# EAGLE board Artemis_Iridium_Tracker (EAGLE 9.5.2)
REVISION: A
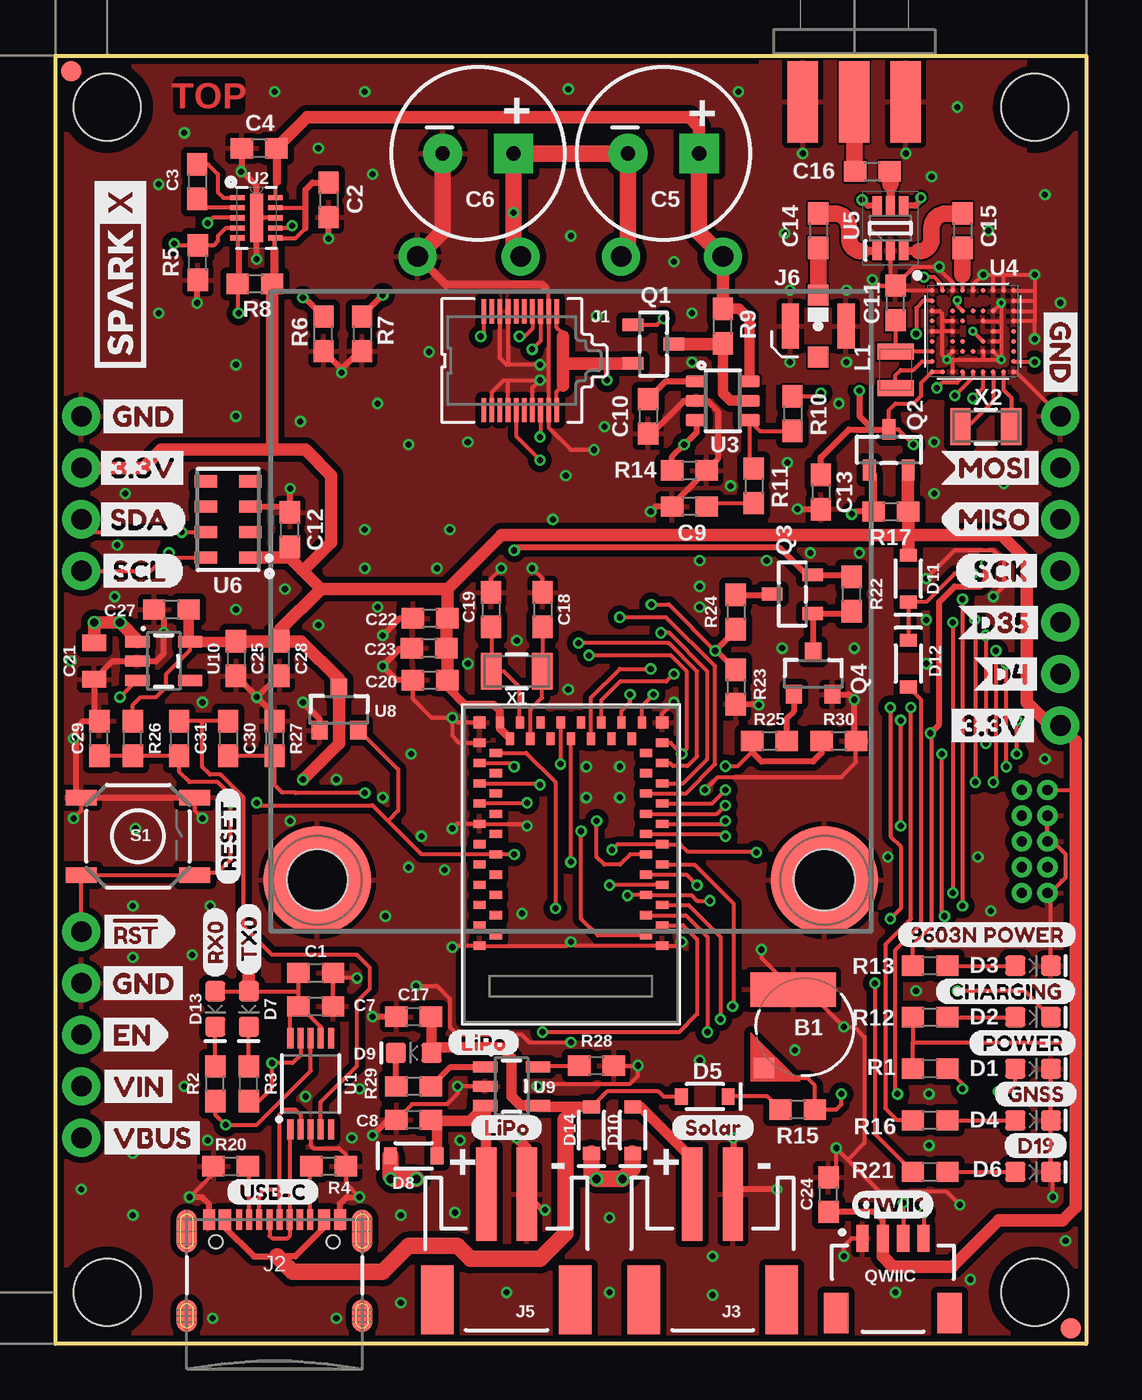
[diagram p4: board, top side]
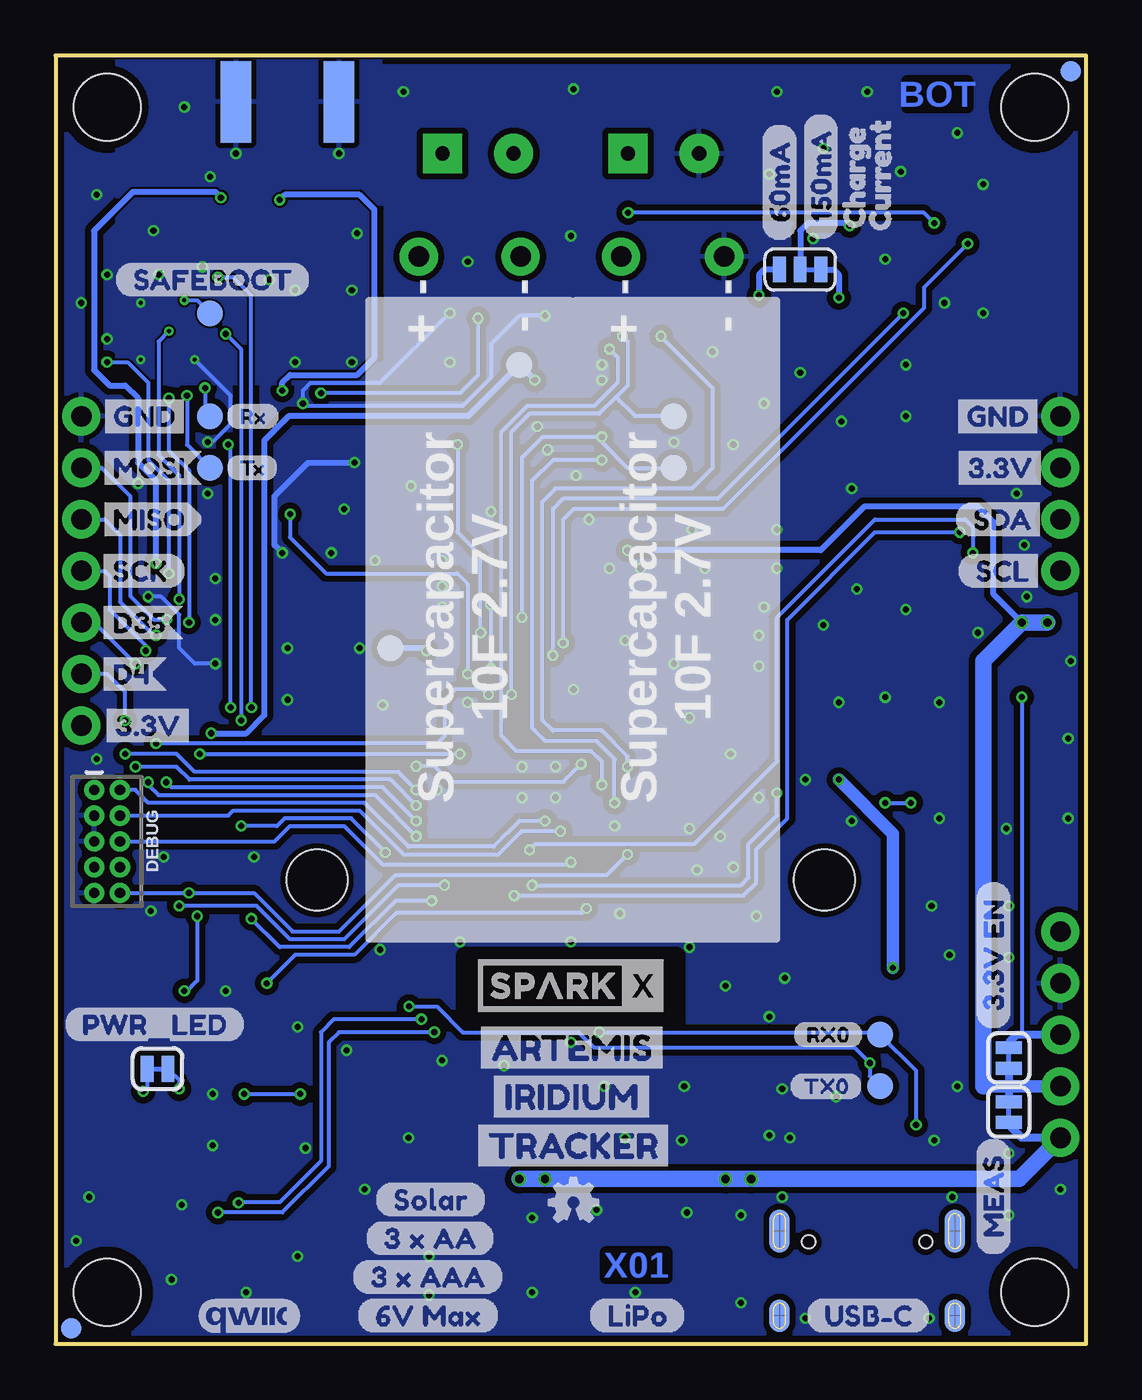
[diagram p5: board, bottom side, seen from below]

Size 50.8 x 63.5 mm. Coordinates in mm from the lower left corner, seen from the top.
Outline: 0,0 0,63.5 50.8,63.5 50.8,0 0,0
Copper layers (1*16): Top 0.035mm / dielectric 1.5mm / Bottom 0.035mm
Design rules "SparkFun-2-layer-FAB-LIMIT": minimum track width 4mil, minimum drill 6mil, track to track 4mil, track to pad 4mil, pad to pad 4mil, via to via 4mil, smd to smd 4mil, copper to edge 4mil, drill to drill 4mil, minimum pad ring 5mil, minimum via ring 5mil, stop-mask expansion 4mil, vias tented up to drill 25mil, thermal gap 10mil
Net classes: 1 3.3V: width 0.203 mm
tRestrict: area 20.2,15.9 to 30.6,19.1
bRestrict: area 20.2,15.9 to 30.6,19.1

## Footprints (pad centres in the part's own frame; a part is rotated, then mirrored left to right if it is on the bottom)
SMT-JUMPER_2_NC_TRACE_SILK = smd 0.635 x 1.27: 1 -0.508,0; 2 0.508,0
PAD.03X.05 = smd 1.27 x 1.27: P$1 0,0
1X01_NO_SILK = drill 1.016 pad 1.88: 1 0,0
ML414H_IV01E = smd 1 x 1: + 2.022,2.032 | smd 4.2 x 1.7: - 0.6,-1.85
0603 = smd 1.1 x 1: 1 -0.85,0; 2 0.85,0
CPOL-RADIAL-1F-2.7V = drill 0.7 pad 1.93 square: + 1.75,0 | drill 0.7 pad 1.93: - -1.75,0
0805 = smd 0.8 x 1.2: 1 -0.9,0; 2 0.9,0
LED-0603 = smd 1 x 1: A -0.877,0; C 0.877,0
SOD-323 = smd 0.63 x 0.83: A 1.15,0; C -1.15,0
2X5-PTH-1.27MM-NO_SILK = drill 0.508 pad 1: 1 -2.54,-0.635; 2 -2.54,0.635; 3 -1.27,-0.635; 4 -1.27,0.635; 5 0,-0.635; 6 0,0.635; 7 1.27,-0.635; 8 1.27,0.635; 9 2.54,-0.635; 10 2.54,0.635
1X04_NO_SILK = drill 1.016 pad 1.88: 1 0,0; 2 2.54,0; 3 5.08,0; 4 7.62,0
IRIDIUM_9603N = smd 0.23 x 1.2: 1 11.8,28.035; 2 11.8,23.165; 3 11.4,28.035; 4 11.4,23.165; 5 11,28.035; 6 11,23.165; 7 10.6,28.035; 8 10.6,23.165; 9 10.2,28.035; 10 10.2,23.165; 11 9.8,28.035; 12 9.8,23.165; 13 9.4,28.035; 14 9.4,23.165; 15 9,28.035; 16 9,23.165; 17 8.6,28.035; 18 8.6,23.165; 19 8.2,28.035; 20 8.2,23.165 | smd 5.3 x 5.3: HOLE1 0,0; HOLE2 25,0 | hole 3: 0,0; 25,0
USB-C-16P = smd 0.3 x 1: A5 -1.25,-0.34; A6 -0.25,-0.34; A7 0.25,-0.34; A8 1.25,-0.34; B5 1.75,-0.34; B6 0.75,-0.34; B7 -0.75,-0.34; B8 -1.75,-0.34 | smd 0.6 x 1: GND -3.225,-0.34; GND2 3.225,-0.34; VBUS1 -2.45,-0.34; VBUS2 2.45,-0.34 | smd 1 x 2.1: SHLD1 -4.32,-0.915; SHLD2 4.32,-0.915 | smd 1 x 2.1 bottom: SHLD3 -4.32,-0.915; SHLD4 4.32,-0.915 | smd 1 x 1.6: SHLD5 -4.32,-5.095; SHLD8 4.32,-5.095 | smd 1 x 1.6 bottom: SHLD6 -4.32,-5.095; SHLD7 4.32,-5.095 | hole 0.65: -2.89,-1.445; 2.89,-1.445
JST-2-SMD = smd 1 x 4.6: 1 -1,-3.7; 2 1,-3.7 | smd 1.6 x 3.4: NC1 -3.4,1.5; NC2 3.4,1.5
1X02_NO_SILK = drill 1.016 pad 1.88: 1 0,0; 2 2.54,0
U.FL = smd 2.2 x 0.85: 1 0,1.375; 2 0,-1.375 | smd 1.05 x 1: FEED 1.525,0; NC -1.525,0
SMA-EDGE = smd 1.5 x 4: GND@0 -2.54,0; GND@1 2.54,0; SIG 0,0 | smd 1.5 x 4 bottom: GND@2 -2.54,0; GND@3 2.54,0
SMT-JUMPER_3_1-NC_TRACE_SILK = smd 0.635 x 1.27: 1 -1.016,0; 2 0,0; 3 1.016,0
FIDUCIAL-1X2 = smd 1 x 1: 1 0,0
STAND-OFF = hole 3.302: 0,0
0806 = smd 0.8 x 1.8: 1 -0.9,0; 2 0.9,0
SOT23-R = smd 0.635 x 1.016: 1 -0.95,-1; 2 0.95,-1; 3 0,1
SOT23-3 = smd 0.8 x 0.9: 1 -0.95,-1; 2 0.95,-1; 3 0,1.1
JST04_1MM_RA = smd 0.6 x 1.35: 1 -1.5,0; 2 -0.5,0; 3 0.5,0; 4 1.5,0 | smd 1.2 x 2: NC1 2.8,-3.675; NC2 -2.8,-3.675
TACTILE_SWITCH_SMD_5.2MM = smd 1.524 x 0.762: 1 -2.794,1.905; 2 2.794,1.905; 3 -2.794,-1.905; 4 2.794,-1.905
1X07_NO_SILK = drill 1.016 pad 1.88: 1 0,0; 2 2.54,0; 3 5.08,0; 4 7.62,0; 5 10.16,0; 6 12.7,0; 7 15.24,0
MSOP10 = smd 1 x 0.3: 1 -2.25,1; 2 -2.25,0.5; 3 -2.25,0; 4 -2.25,-0.5; 5 -2.25,-1; 6 2.25,-1; 7 2.25,-0.5; 8 2.25,0; 9 2.25,0.5; 10 2.25,1
DFN300X200-10L = smd 0.711 x 0.254: 1 -0.94,0.991; 2 -0.94,0.508; 3 -0.94,0; 4 -0.94,-0.508; 5 -0.94,-0.991; 6 0.94,-0.991; 7 0.94,-0.508; 8 0.94,0; 9 0.94,0.508; 10 0.94,0.991 | smd 0.635 x 2.388: 11 0,0
TSOT6 = smd 0.6 x 1.05: 1 -0.95,-1.3; 2 0,-1.3; 3 0.95,-1.3; 4 0.95,1.3; 5 0,1.3; 6 -0.95,1.3
UBLOX_ZOE_M8-0-10 = smd 0.25 x 0.25: 1 -1.996,2.004; 2 -1.496,2.004; 3 -0.996,2.004; 4 -0.496,2.004; 5 0.004,2.004; 6 0.504,2.004; 7 1.004,2.004; 8 1.504,2.004; 9 2.004,2.004; 10 2.004,1.504; 11 2.004,1.004; 12 2.004,0.504; 13 2.004,0.004; 14 2.004,-0.496; 15 2.004,-0.996; 16 2.004,-1.496; 17 2.004,-1.996; 18 1.504,-1.996; 19 1.004,-1.996; 20 0.504,-1.996; 21 0.004,-1.996; 22 -0.496,-1.996; 23 -0.996,-1.996; 24 -1.496,-1.996; 25 -1.996,-1.996; 26 -1.996,-1.496; 27 -1.996,-0.996; 28 -1.996,-0.496; 29 -1.996,0.004; 30 -1.996,0.504; 31 -1.996,1.004; 32 -1.996,1.504; 33 -0.996,1.004; 34 -0.496,1.004; 35 0.004,1.004; 36 0.504,1.004; 37 1.004,1.004; 38 1.004,0.004; 39 1.004,-0.496; 40 1.004,-0.996; 41 0.504,-0.996; 42 0.004,-0.996; 43 -0.496,-0.996; 44 -0.996,-0.996; 45 -0.996,-0.496; 46 -0.996,0.004; 47 -0.996,0.504; 48 -0.496,0.504; 49 0.504,0.504; 50 0.504,-0.496; 51 -0.496,-0.496
SOT65P220X100-6N = smd 0.95 x 0.45: 1 -1.1,0.65; 2 -1.1,0; 3 -1.1,-0.65; 4 1.1,-0.65; 5 1.1,0; 6 1.1,0.65
MS8607-02BA01 = smd 1.1 x 0.6: 1 -1.1,1.875; 2 -1.1,0.625; 3 -1.1,-0.625; 4 -1.1,-1.875; 5 1.1,-1.875; 6 1.1,-0.625; 7 1.1,0.625; 8 1.1,1.875
ARTEMIS_FP = smd 0.4 x 0.6: AD16 -4,-3.7; BOOT 1.5,4.5; D0 0.5,-4.5; D1 -0.5,-4.5; D2 -1,-3.7; D3 2,-3.7; D7 -1.5,4.5; D8 -0.5,4.5; D9 2,3.7; D10 1,3.7; D14 -5,3.7; D17 -3.5,-4.5; D36 2.5,-4.5; D38 3,-3.7; D40 2.5,4.5; D41 -2.5,-4.5; GND@1 4.5,4.5; GND@39 -5.5,-4.5; GND@47 -1.5,-4.5; GND@59 4.5,-4.5; RXI-0 3.5,4.5; SWDCK 4,3.7; SWDIO 0,3.7; TXO-0 0.5,4.5; ~AD31 -3,-3.7; ~AD35 -2,3.7; ~D4 -2.5,4.5; ~D5 -1,3.7; ~D18 -4.5,-4.5; ~D19 -5,-3.7; ~D22 -3.5,4.5; ~D23 -4,3.7; ~D24 -3,3.7; ~D27 -4.5,4.5; ~D28 -5.5,4.5; ~D37 3.5,-4.5; ~D39 3,3.7; ~D42 1.5,-4.5; ~D43 1,-3.7; ~D44 4,-3.7; ~D45 -2,-3.7; ~RST 0,-3.7 | smd 0.6 x 0.4: AD34 -6.5,-0.5; D15 -6.5,0.5; VDD@36 -5.7,-3; VDD@37 -6.5,-3.5; XI -6.5,-2.5; XO -5.7,-2; ~AD11 -5.7,-1; ~AD12 -5.7,2; ~AD13 -5.7,1; ~AD29 -6.5,-1.5; ~AD32 -5.7,3; ~AD33/SWO -5.7,0; ~D6 -6.5,3.5; ~D25 -6.5,2.5; ~D26 -6.5,1.5 | smd 0.6 x 0.6: GND@22 -6.5,4.5; GND@38 -6.5,-4.5
SSOP3 = smd 0.8 x 0.9: 1 -0.95,-1; 2 0.95,-1; 3 0,1.1
SOT23-5 = smd 0.55 x 1.2: 1 -0.95,-1.3; 2 0,-1.3; 3 0.95,-1.3; 4 0.95,1.3; 5 -0.95,1.3
CRYSTAL-SMD-3.2X1.5MM = smd 1 x 1.8: P$1 -1.25,0; P$2 1.25,0

## Placement (x,y rotation side)
3V3EN  JUMPER-SMT_2_NC_TRACE_SILK  [SMT-JUMPER_2_NC_TRACE_SILK]  3.81,14.1 90 bottom
5V3  TEST-POINT3X5  [PAD.03X.05]  27.94,48.26 0 bottom
!RESET  [1X01_NO_SILK]  1.27,20.32 0 top
B1  ML414H_IV01E_BATTERY  [ML414H_IV01E]  36.96,15.62 180 top
C1  10nF  [0603]  12.83,18.29 0 top
C2  2.2uF  [0603]  13.46,56.39 270 top
C3  1.0uF  [0603]  6.99,57.28 270 top
C4  0.22uF  [0603]  10.03,58.93 180 top
C5  1F 2.7V  [CPOL-RADIAL-1F-2.7V]  29.97,58.67 0 top
C6  1F 2.7V  [CPOL-RADIAL-1F-2.7V]  20.83,58.67 0 top
C7  0.1uF  [0603]  12.83,16.64 0 top
C8  4.7uF  [0603]  17.65,11.05 180 top
C9  10nF  [0603]  31.24,41.27 180 top
C10  1.0uF  [0603]  29.21,45.72 270 top
C11  4.7uF  [0603]  41.4,51.31 90 top
C12  0.22uF  [0603]  11.56,40.13 90 top
C13  0.1uF  [0603]  37.72,41.99 270 top
C14  100pF  [0603]  37.59,54.86 270 top
C15  100pF  [0603]  44.7,54.86 270 top
C16  100pF  [0603]  40.26,57.78 0 top
C17  4.7uF  [0603]  17.65,16.13 180 top
C18  15pF  [0603]  24,36.2 270 top
C19  15pF  [0603]  21.46,36.2 270 top
C20  0.1uF  [0603]  18.47,32.72 0 top
C21  22uF  [0805]  1.91,33.66 270 top
C22  10uF  [0603]  18.47,35.76 180 top
C23  1.0uF  [0603]  18.41,34.29 180 top
C24  1.0uF  [0603]  38.1,7.37 90 top
C25  22uF  [0603]  8.89,33.78 270 top
C27  1.0uF  [0603]  5.71,36.2 180 top
C28  0.1uF  [0603]  11.05,33.78 270 top
C29  1nF  [0603]  2.16,29.84 90 top
C30  0.1uF  [0603]  8.51,29.84 270 top
C31  0.1uF  [0603]  6.1,29.84 270 top
D1  GREEN  [LED-0603]  48.18,13.56 0 top
D2  Yellow  [LED-0603]  48.18,16.1 0 top
D3  RED  [LED-0603]  48.18,18.64 0 top
D4  BLUE  [LED-0603]  48.18,11.02 0 top
D5  0.5A/40V/420mV  [SOD-323]  32,12.19 180 top
D6  WHITE  [LED-0603]  48.18,8.48 0 top
D7  GREEN  [LED-0603]  9.53,16.51 270 top
D8  0.5A/40V/420mV  [SOD-323]  17.65,9.27 0 top
D9  Yellow  [LED-0603]  17.65,14.35 180 top
D10  0.5A/40V/420mV  [SOD-323]  28.45,10.54 90 top
D11  0.5A/40V/420mV  [SOD-323]  42.04,37.72 90 top
D12  0.5A/40V/420mV  [SOD-323]  42.04,33.53 270 top
D13  Yellow  [LED-0603]  7.87,16.51 270 top
D14  0.5A/40V/420mV  [SOD-323]  26.42,10.54 90 top
DEBUG  CORTEX_DEBUG  [2X5-PTH-1.27MM-NO_SILK]  48.26,24.77 270 bottom
EN  [1X01_NO_SILK]  1.27,15.24 0 top
FRAME1  FRAME-LETTER  [CREATIVE_COMMONS]  -7.62,-13.97 0 top  (outside the outline)
FRAME2  FRAME-LETTER  [CREATIVE_COMMONS]  -7.62,-13.97 0 top  (outside the outline)
FRAME3  FRAME-LETTER  [CREATIVE_COMMONS]  -7.62,-13.97 0 top  (outside the outline)
FRAME4  FRAME-LETTER  [CREATIVE_COMMONS]  -7.62,-13.97 0 top  (outside the outline)
GND  [1X01_NO_SILK]  1.27,17.78 0 top
GPS_RX  TEST-POINT3X5  [PAD.03X.05]  43.18,45.72 0 bottom
GPS_TX  TEST-POINT3X5  [PAD.03X.05]  43.18,43.18 0 bottom
I2C  PTH  [1X04_NO_SILK]  1.27,45.72 270 top
J1  IRIDIUM_9603N  [IRIDIUM_9603N]  12.9,22.86 0 top
J2  USB-C  [USB-C-16P]  10.79,6.48 0 top
J3  [JST-2-SMD]  32.38,3.68 180 top
J4  [1X02_NO_SILK]  1.27,12.7 270 top
J5  [JST-2-SMD]  22.23,3.68 180 top
J6  U.FL  [U.FL]  37.59,50.16 90 top
J7  ANTENNA-GROUNDEDEDGE_SMA  [SMA-EDGE]  39.37,61.21 0 top
JP1  JUMPER-SMT_3_1-NC_TRACE_SILK  [SMT-JUMPER_3_1-NC_TRACE_SILK]  14.1,52.96 0 bottom
JP2  JUMPER-SMT_2_NC_TRACE_SILK  [SMT-JUMPER_2_NC_TRACE_SILK]  45.77,13.56 0 bottom
JP7  FIDUCIAL1X2  [FIDUCIAL-1X2]  0.76,62.74 0 bottom
JP8  FIDUCIAL1X2  [FIDUCIAL-1X2]  50.04,0.76 0 top
JP9  STAND-OFF  [STAND-OFF]  2.54,60.96 0 top
JP10  STAND-OFF  [STAND-OFF]  48.26,60.96 0 top
JP11  STAND-OFF  [STAND-OFF]  2.54,2.54 0 top
JP12  STAND-OFF  [STAND-OFF]  48.26,2.54 0 top
JP13  FIDUCIAL1X2  [FIDUCIAL-1X2]  50.04,0.76 0 bottom
JP14  FIDUCIAL1X2  [FIDUCIAL-1X2]  0.76,62.74 0 top
L1  2.2uH  [0806]  41.4,48.01 270 top
LOGO4  OSHW-LOGOMINI  [OSHW-LOGO-MINI]  25.27,6.99 0 bottom
MEAS  JUMPER-SMT_2_NC_TRACE_SILK  [SMT-JUMPER_2_NC_TRACE_SILK]  3.81,11.43 90 bottom
Q1  DMG3414U-7  [SOT23-R]  29.46,49.28 270 top
Q2  DMG3415U-7  [SOT23-R]  41.07,44.07 0 top
Q3  DMG3415U-7  [SOT23-R]  36.32,36.96 90 top
Q4  600mA/40V  [SOT23-3]  37.34,33.02 0 top
QWIIC  QWIIC_RIGHT_ANGLE  [JST04_1MM_RA]  41.27,5.21 0 top
R1  1k  [0603]  43.1,13.56 180 top
R2  1k  [0603]  7.87,12.83 90 top
R3  1k  [0603]  9.53,12.83 90 top
R4  5.1k  [0603]  13.46,8.76 180 top
R5  10k  [0603]  7.01,53.29 90 top
R6  12k  [0603]  13.21,49.78 90 top
R7  30.1k  [0603]  15.11,49.78 270 top
R8  100k  [0603]  9.83,52.25 0 top
R9  0.012R  [0603]  32.89,50.16 90 top
R10  100  [0603]  36.32,45.85 270 top
R11  100  [0603]  34.42,42.29 270 top
R12  1k  [0603]  43.1,16.1 180 top
R13  2.2k  [0603]  43.1,18.64 180 top
R14  10k  [0603]  31.24,43.05 0 top
R15  62KOHM-0603-1/10W-5%  [0603]  36.58,11.56 180 top
R16  1k  [0603]  43.1,11.02 180 top
R17  10k  [0603]  41.17,41.02 0 top
R20  5.1k  [0603]  8.64,8.76 0 top
R21  1k  [0603]  43.1,8.48 180 top
R22  10k  [0603]  39.24,36.96 90 top
R23  10k  [0603]  33.53,32.38 270 top
R24  20k  [0603]  33.53,36.07 270 top
R25  1k  [0603]  35.18,29.72 0 top
R26  100k  [0603]  3.81,29.84 90 top
R27  220k  [0603]  10.79,29.84 270 top
R28  2.0k  [0603]  26.67,13.72 180 top
R29  1k  [0603]  17.65,12.7 180 top
R30  10k  [0603]  38.61,29.72 0 top
RX0  TEST-POINT3X5  [PAD.03X.05]  10.16,15.24 0 bottom
RX1  TEST-POINT3X5  [PAD.03X.05]  20.32,45.72 0 bottom
S1  RESET  [TACTILE_SWITCH_SMD_5.2MM]  4.06,25.02 0 top
SAFEBOOT  TEST-POINT3X5  [PAD.03X.05]  43.18,50.8 0 bottom
SC1+  [1X01_NO_SILK]  32.89,53.59 0 top
SC1-  [1X01_NO_SILK]  27.88,53.59 0 top
SC2+  [1X01_NO_SILK]  22.92,53.59 0 top
SC2-  [1X01_NO_SILK]  17.84,53.59 0 top
SPARKX1  SPARKX-LOGO4  [SPARKX-MEDIUM]  3.2,52.7 90 top
SPARKX2  SPARKX-LOGO4  [SPARKX-MEDIUM]  25.4,17.65 0 bottom
SPI  [1X07_NO_SILK]  49.53,45.72 270 top
TX0  TEST-POINT3X5  [PAD.03X.05]  10.16,12.7 0 bottom
TX1  TEST-POINT3X5  [PAD.03X.05]  20.32,43.18 0 bottom
U1  CH340E_MSOP10  [MSOP10]  12.57,12.83 90 top
U2  LTC3225EDDB#TRMPBF  [DFN300X200-10L]  9.91,55.5 0 top
U3  ADM4210-1  [TSOT6]  32.89,46.48 270 top
U4  UBLOX_ZOE_M8-0-10  [UBLOX_ZOE_M8-0-10]  45.21,49.91 0 top
U5  AS179-92LF  [SOT65P220X100-6N]  41.15,54.99 90 top
U6  MS8607-02BA01  [MS8607-02BA01]  8.51,40.64 180 top
U7  ARTEMIS_MODULESMD  [ARTEMIS_FP]  25.4,24.13 270 top
U8  V_SUPERVISORBD48K24G-TL  [SSOP3]  13.97,31.24 0 top
U9  MCP73831  [SOT23-5]  22.48,12.7 270 top
U10  3.3V  [SOT23-5]  5.33,33.66 270 top
U$1  [60MA0]  15.11,54.36 90 bottom
U$2  [POWER0]  45.01,14.83 0 top
U$3  [GND1]  6.78,45.72 0 bottom
U$4  [3#3V2]  6.76,43.18 0 bottom
U$5  [SCL0]  6.35,38.1 0 bottom
U$6  [SDA0]  6.48,40.64 0 bottom
U$7  [EN0]  1.91,15.24 0 top
U$9  [CHARGING0]  43.36,17.37 0 top
U$10  [9603N_POWER0]  41.45,20.17 0 top
U$11  [QWIIC_4MM]  41.27,6.86 0 top
U$12  [GND1]  48.84,45.72 0 bottom
U$13  [150MA0]  13.08,54.36 90 bottom
U$14  [CHARGE0]  11.43,54.1 90 bottom
U$15  [CURRENT0]  10.16,53.98 90 bottom
U$16  [TX00]  9.53,18.16 90 top
U$17  [GND1]  49.53,51.31 270 top
U$18  [SCK0]  44.32,38.1 0 top
U$19  [GNSS0]  46.23,12.32 0 top
U$20  [3#3V2]  48.77,30.48 0 bottom
U$21  [3#3V2]  1.78,43.18 0 top
U$22  [GND1]  1.91,45.72 0 top
U$23  [RX00]  7.87,18.03 90 top
U$24  [3#3V2]  43.69,30.48 0 top
U$25  [QWIIC_5MM]  41.27,1.4 0 bottom
U$26  [SCL9]  1.91,38.1 0 top
U$27  [SDA8]  1.78,40.64 0 top
U$29  [SOLAR0]  30.35,10.67 0 top
U$31  [SCK0]  48.9,38.1 0 bottom
U$32  [5#3V0]  27.94,42.67 90 bottom
U$33  [RX0]  42.42,45.72 0 bottom
U$34  [RX00]  14.48,15.24 0 bottom
U$35  [RX10]  19.56,45.72 0 bottom
U$36  [SAFEBOOT0]  47.88,52.45 0 bottom
U$37  [TX0]  42.42,43.18 0 bottom
U$38  [TX00]  14.61,12.7 0 bottom
U$39  [TX10]  19.68,43.18 0 bottom
U$40  [ARTEMIS0]  30.48,14.61 0 bottom
U$41  [IRIDIUM0]  29.84,12.19 0 bottom
U$42  [TRACKER0]  30.61,9.78 0 bottom
U$43  [PWR_LED0]  50.42,15.75 0 bottom
U$44  [VBUS0]  1.91,10.16 0 top
U$45  [LIPO0]  20.45,10.67 0 top
U$46  [LIPO0]  19.3,14.86 0 top
U$47  [3#3V_EN0]  4.57,15.49 90 bottom
U$48  [MEAS0]  4.57,4.32 90 bottom
U$49  [RESET0]  8.51,22.61 90 top
U$50  [D190]  46.74,9.78 0 top
U$53  [USB#C0]  13.84,1.4 0 bottom
U$56  [USB#C0]  8.38,7.49 0 top
U$57  [LIPO0]  24.51,1.4 0 bottom
U$58  [#RST0]  1.78,20.32 0 top
U$59  [GND0]  1.91,17.78 0 top
U$60  [VIN0]  1.91,12.7 0 top
U$61  [3_X_AA0]  35.56,5.21 0 bottom
U$62  [3_X_AAA0]  36.2,3.3 0 bottom
U$63  [6V_MAX0]  35.94,1.4 0 bottom
U$64  [SOLAR0]  35.05,7.11 0 bottom
U$65  [VIN#30]  34.16,35.05 90 bottom
U$67  [D350]  48.9,35.56 0 bottom
U$68  [D350]  44.45,35.56 0 top
U$69  [MISO0]  48.9,40.64 0 bottom
U$70  [MISO0]  43.56,40.64 0 top
U$71  [MOSI0]  43.56,43.18 0 top
U$72  [MOSI0]  48.9,43.18 0 bottom
U$73  [D40]  45.21,33.02 0 top
U$74  [D40]  48.9,33.02 0 bottom
VIN/3  TEST-POINT3X5  [PAD.03X.05]  34.29,34.29 270 bottom
X1  32.768kHz  [CRYSTAL-SMD-3.2X1.5MM]  22.73,33.15 0 top
X2  32.768kHz  [CRYSTAL-SMD-3.2X1.5MM]  45.85,45.21 0 top

## Tracks (layer width: path | path; a pad name or v marks a point on that pad's centre or on a via)
3.3V  (via drill 0.3)
  Top 0.203: 10.79,53.98 10.79,54.46 U2.6 11.84,54.51 12.32,54.99 | U2.9 12.32,56.01 | C7.1 11.98,17.4 | 11.98,17.4 C1.1 | D13.A D7.A 11.96,17.39 11.98,17.4 | U1.10 11.57,16.23 C7.1 | U1.7 13.07,15.63 12.06,16.64 C7.1 | R26.2 3.81,31.5 4.19,31.88 4.95,31.88 5.46,32.38 5.46,33.02 6.63,34.19 U10.5 | DEBUG.1 50.29,27.3 | R1.2 42.25,14.86 | 42.25,14.86 50.29,14.86 | R12.2 42.25,14.86
  Top 0.305: R8.2 10.79,52.36 | C2.1 12.66,57.24 12.32,56.9 12.32,56.01 12.32,54.99 | QWIIC.2 40.77,6.09 40.35,6.52 C24.1
  Top 0.406: U7.VDD@36 21.9,30.33 U7.VDD@37 21.9,31.19 21.59,31.5 20.19,31.5 19.32,32.37 C20.2 | 19.32,34.24 C23.1 | 10.79,52.36 10.79,53.98
  Top 0.508: C27.1 6.57,34.67 U10.5 8.86,34.6 C25.1
  Top 0.61: C20.2 19.32,34.24 | C23.1 19.27,35.71 C22.1 19.32,37.21 | C25.1 C28.1 | C28.1 11.05,35.18 13.08,37.21 | 13.08,37.21 19.32,37.21 | U6.1 11.53,38.77 | 11.53,38.77 11.56,38.77 C12.1 | 11.53,38.77 12.13,38.16 | 12.13,38.16 13.08,37.21 | D11.A 42.02,38.88 42.02,39.88 | 42.02,39.88 R17.2 Q2.2 | 42.02,39.88 46.61,39.88 47.88,38.61 47.88,31.62 49.02,30.48 SPI.7 50.29,29.72 50.29,27.3 50.29,14.86 50.29,6.73 49.66,6.1 46.48,6.1 44.2,3.81 41.27,3.81 40.77,4.31 QWIIC.2 | v9.53,18.54 D7.A | I2C.2 4.32,43.18 5.21,44.07 10.67,44.07 | 10.67,44.07 12.32,44.07 13.59,42.8 13.59,39.5 12.26,38.16 12.13,38.16 | 10.67,44.07 10.68,44.08 R8.2 | 19.32,37.21 21.98,39.88 42.02,39.88 | C28.1 12.1,34.63 13.97,32.77 U8.3 13.97,29.59 v12.19,27.81
  Bottom 0.61: v12.19,27.81 9.53,25.15 v9.53,18.54
3V3SW  (via drill 0.3)
  Top 0.203: Q2.3 41.07,46.02 41.4,46.35 42.29,46.35 42.67,46.74 42.67,47.37 U4.25 U4.24 | 40.27,45.07 Q2.3 | R16.2 41.49,11.02 40.89,11.62 40.89,19.68 42.16,20.95 v42.16,31.37 | v42.29,44.32 41.55,45.07 Q2.3
  Top 0.305: U5.6 40.05,56.09 v39.75,56.39 | v39.62,46.99 39.62,45.72 40.27,45.07 | C13.1 37.72,43.69 39.1,45.07 Q2.3
  Bottom 0.203: v42.16,31.37 42.16,44.2 v42.29,44.32
  Bottom 0.305: v39.62,46.99 39.62,47.37 39.24,47.75 35.94,47.75 35.08,48.61 35.08,55.91 35.81,56.64 39.5,56.64 v39.75,56.39
ANTENNA
  Top 0.813: 39.37,57.82 C16.1 39.37,57.82 | 39.37,57.82 J7.SIG
ARTEMIS_!RESET  (via drill 0.3)
  Top 0.203: C29.1 R26.1 C31.2 6.1,28.19 6.6,27.69 8,27.69 8.64,27.05 v8.64,26.67 8.64,23.88 8,23.24 6.99,23.24 S1.4 S1.3 !RESET.1 | 16.38,25.78 15.62,26.54 10.03,26.54 v9.91,26.67 | 16.38,25.78 18.03,24.13 U7.~RST v22.61,24.13 | U4.20 45.72,47.11 v45.21,46.61 | v44.22,35.56 v44.22,22.23 | U8.2 14.97,30.24 16.89,28.32 16.89,26.29 16.38,25.78
  Bottom 0.203: v9.91,26.67 v8.64,26.67 | DEBUG.10 v44.22,22.23 41.02,22.23 39.12,20.32 36.83,20.32 34.04,23.11 23.62,23.11 v22.61,24.13 | v45.21,46.61 45.21,44.04 44.22,43.05 v44.22,35.56
ARTEMIS_!RTS!
  Top 0.203: U1.4 13.07,11.93 14.86,13.72 14.86,16.89 15.49,17.53 15.49,18.54 14.86,19.18 10.67,19.18 9.27,20.57 9.27,26.92 8.13,28.07 7.62,28.07 7.24,28.45 7.24,30.61 7.15,30.7 | 7.15,30.7 C31.1 | C30.1 7.15,30.7
ARTEMIS_BOOT  (via drill 0.3)
  Top 0.203: C30.2 R27.2 10.79,27.56 11.18,27.18 11.81,27.18 11.84,27.15 v15.24,27.15 | U7.BOOT 27.33,22.63 v27.3,22.61
  Bottom 0.203: v27.3,22.61 17.02,22.61 16.64,22.99 16.64,24.64 15.24,26.04 v15.24,27.15
ARTEMIS_D4  (via drill 0.3)
  Top 0.203: U7.~D4 32.34,26.63 v33.02,27.3 | v47.37,29.08 v47.37,30.73
  Bottom 0.203: v33.02,27.3 33.91,28.19 43.94,28.19 44.83,29.08 v47.37,29.08 | v47.37,30.73 47.37,32.13 48.26,33.02 SPI.6
ARTEMIS_D5_SCK  (via drill 0.3)
  Top 0.203: U7.~D5 32.91,25.13 v33.02,25.02 | v46.35,34.16 46.35,27.81 v46.23,27.69
  Bottom 0.203: v33.02,25.02 35.05,27.05 45.72,27.05 46.23,27.56 v46.23,27.69 | SPI.4 48.39,38.1 48.13,37.85 48.13,36.2 46.35,34.42 v46.35,34.16
ARTEMIS_D6_MISO  (via drill 0.3)
  Top 0.203: U7.~D6 28.9,31.44 v29.46,32 | v45.85,34.92 v45.85,29.59
  Bottom 0.203: SPI.3 48.39,40.64 47.62,39.88 47.62,36.58 45.97,34.92 v45.85,34.92 | v29.46,32 29.72,32.26 31.11,32.26 31.62,31.75 31.62,29.97 32,29.59 v45.85,29.59
ARTEMIS_D7_MOSI  (via drill 0.3)
  Top 0.203: U7.D7 32.87,25.63 v33.02,25.78 | v45.32,35.71 45.34,35.69 v45.34,27.69
  Bottom 0.203: SPI.2 48.51,43.18 47.12,41.78 47.12,36.85 45.97,35.71 v45.32,35.71 | v33.02,25.78 34.67,27.43 45.09,27.43 v45.34,27.69
ARTEMIS_D8_SCL  (via drill 0.3)
  Top 0.203: U4.32 42.78,51.41 42.42,51.05 v42.42,49.78 | v34.54,24.23 34.52,24.25 31.17,24.25 30.79,24.63 U7.D8 27.71,24.63 v27.43,24.36 | v41.66,25.53 v41.66,30.73 | U6.8 5.81,38.77 v5.59,38.99 4.7,38.1 I2C.4
  Bottom 0.203: v42.42,49.78 41.66,49.02 v41.66,30.73 | v41.66,25.53 39.88,25.53 39.5,25.91 36.22,25.91 v34.54,24.23 | v5.59,38.99 5.59,40.26 5.97,40.64 10.41,40.64 15.24,35.81 15.24,28.72 19.32,24.64 27.15,24.64 v27.43,24.36
ARTEMIS_D9_SDA  (via drill 0.3)
  Top 0.203: v28.19,22.1 28.23,22.13 U7.D9 31.34,22.13 31.62,21.84 v32.26,21.84 | v6.22,40.01 6.23,40.02 | 6.23,40.02 U6.7 | I2C.3 1.9,40.02 6.23,40.02 | U4.2 43.72,52.17 43.31,52.58 v42.8,52.58 | v41.15,31.37 41.15,25.02 41.66,24.51 41.66,21.46 v41.15,20.95
  Bottom 0.203: v28.19,22.1 16.89,22.1 16.26,22.73 16.26,24.38 14.73,25.91 14.73,35.69 10.41,40.01 v6.22,40.01 | v42.8,52.58 42.04,52.58 41.15,51.69 v41.15,31.37 | v32.26,21.84 34.04,21.84 36.32,19.56 39.75,19.56 v41.15,20.95
ARTEMIS_D10  (via drill 0.2, 0.3)
  Top 0.203: U7.D10 31.1,23.13 v31.62,22.61 | v44.7,36.7 v44.7,21.59 | v45.21,49.91 45.71,49.41 U4.50
  Bottom 0.203: v31.62,22.61 33.91,22.61 36.58,19.94 39.24,19.94 40.89,21.59 v44.7,21.59 | v45.21,49.91 U4.50 45.72,43.81 44.7,42.8 v44.7,36.7
ARTEMIS_D13  (via drill 0.3)
  Top 0.203: U7.~AD13 26.4,31.86 27.81,33.27 v29.34,33.27 | v29.36,36.45 30.23,36.45 v32.51,34.16
  Top 0.305: R23.1 32.6,34.16 v32.51,34.16 33.53,35.18 R24.2
  Bottom 0.203: v29.36,36.45 29.36,33.3 v29.34,33.27
  Bottom 0.305: v32.51,34.16 32.64,34.29 VIN/3.P$1
ARTEMIS_D17  (via drill 0.3)
  Top 0.203: J1.5 23.9,49.43 v23.5,49.02 | U7.D17 23.8,27.63 v23.88,27.56
  Bottom 0.203: v23.5,49.02 23.11,48.64 23.11,47.37 24.26,46.23 27.56,46.23 28.83,44.96 28.83,29.97 28.07,29.21 24.38,29.21 23.88,28.7 v23.88,27.56
ARTEMIS_D18  (via drill 0.3)
  Top 0.203: J1.19 21.1,49.8 v20.95,49.66 | U7.~D18 22.42,28.63 v22.61,28.45
  Bottom 0.203: v20.95,49.66 18.41,47.12 18.41,43.18 19.43,42.16 26.16,42.16 26.8,41.53 26.8,30.73 26.29,30.23 23.88,30.23 22.61,28.96 v22.61,28.45
ARTEMIS_D19  (via drill 0.3)
  Top 0.203: U7.~D19 23.19,29.13 24.64,27.69 v24.64,21.46 | v40.39,17.78 40.39,10.35 R21.2
  Bottom 0.203: v24.64,21.46 24.86,21.24 34.01,21.24 36.07,19.18 38.99,19.18 v40.39,17.78
ARTEMIS_D22  (via drill 0.3)
  Top 0.203: U7.~D22 30.93,27.63 32.13,28.83 32.13,33.15 30.23,35.05 v29.84,35.05
  Top 0.305: R14.1 30.39,43.73 v30.99,44.32 31.59,44.93 U3.3
  Bottom 0.203: v30.99,44.32 30.99,40.01 29.84,38.86 v29.84,35.05
ARTEMIS_D24  (via drill 0.3)
  Top 0.203: J1.6 23.9,44.73 v23.88,44.7 | U7.~D24 31.07,27.13 32.51,28.57 32.51,33.4 30.1,35.81 v27.81,35.81
  Bottom 0.203: TX1.P$1 22.61,43.18 23.88,44.45 v23.88,44.7 26.8,44.7 27.81,43.69 v27.81,35.81
ARTEMIS_D25  (via drill 0.3)
  Top 0.203: v22.86,49.66 23.12,49.66 23.5,50.04 J1.7 | U7.~D25 27.9,31.2 28.32,31.62 v28.32,32
  Bottom 0.203: v22.86,49.66 22.61,49.4 22.61,47.24 23.18,46.67 | 23.18,46.67 24,45.85 27.43,45.85 28.32,44.96 v28.32,32 | RX1.P$1 22.23,45.72 23.18,46.67
ARTEMIS_D26  (via drill 0.3)
  Top 0.203: U7.~D26 26.9,31.73 27.81,32.64 30.1,32.64 v30.48,33.02
  Top 0.305: Q2.1 40.32,42.87 R17.1 39.37,41.02 v39.24,40.89
  Bottom 0.203: v39.24,40.89 39.24,39.75 37.47,37.97 30.99,37.97 30.48,37.47 v30.48,33.02
ARTEMIS_D27  (via drill 0.3)
  Top 0.203: U2.4 8.38,54.99 8,54.61 8,54.36 7.78,54.14 R5.2 5.93,54.14 v5.84,54.23 | U7.~D27 30.28,28.63 30.43,28.48 31.14,28.48 31.62,28.96 31.62,33.15 30.23,34.54 v25.78,34.54
  Bottom 0.203: v5.84,54.23 8,52.07 8,51.05 17.91,41.15 25.27,41.15 25.78,40.64 v25.78,34.54
ARTEMIS_D28  (via drill 0.3)
  Top 0.203: U2.5 8.97,54.03 9.02,53.98 | D2.C 47.77,17.4 v44.45,17.4 | v43.81,21.08 43.69,21.21 v43.69,29.08 | U7.~D28 30.31,29.63 v30.86,29.08 31.11,29.34 31.11,33.15 30.32,33.94 v26.29,33.94 | R8.1 8.98,50.84 v9.02,50.8
  Top 0.305: 9.02,53.98 9.02,52.28 R8.1
  Bottom 0.203: v43.81,21.08 43.81,17.91 44.32,17.4 v44.45,17.4 | v43.69,29.08 v30.86,29.08 | v9.02,50.8 18.16,41.66 25.78,41.66 26.29,41.15 v26.29,33.94
ARTEMIS_D33  (via drill 0.3)
  Top 0.203: v25.4,23.75 U7.~AD33/SWO
  Bottom 0.203: DEBUG.6 40.01,24.77 39.24,25.53 36.58,25.53 34.67,23.62 25.53,23.62 v25.4,23.75
ARTEMIS_D34  (via drill 0.3)
  Top 0.203: U7.AD34 24.9,28.58 v24.89,28.57 | v33.02,28.48 33.63,28.48 34.33,29.17
  Top 0.305: R30.1 37.76,29.12 37.34,28.7 34.8,28.7 34.33,29.17 R25.1
  Bottom 0.203: v24.89,28.57 25.75,27.71 31.37,27.71 32.13,28.48 v33.02,28.48
ARTEMIS_D35  (via drill 0.3)
  Top 0.203: U7.~AD35 32.61,26.13 v33.02,26.54 | v46.86,28.45 v46.86,33.53
  Bottom 0.203: v33.02,26.54 34.29,27.81 44.2,27.81 44.83,28.45 v46.86,28.45 | v46.86,33.53 48.9,35.56 SPI.5
ARTEMIS_D39_SCL4  (via drill 0.3)
  Top 0.203: U7.~D39 31.07,21.13 32.13,20.07 v32.13,15.37 | v42.8,6.48 42.8,5.23 QWIIC.4
  Bottom 0.203: v32.13,15.37 36.83,15.37 37.34,14.86 37.34,8.76 39.62,6.48 v42.8,6.48
ARTEMIS_D40_SDA4  (via drill 0.3)
  Top 0.203: U7.D40 31.2,21.63 32.77,20.07 v32.77,16 | v41.78,6.96 41.78,5.21 QWIIC.3
  Bottom 0.203: v41.78,6.96 41.76,6.99 39.75,6.99 37.72,9.02 37.72,15.37 37.08,16 v32.77,16
ARTEMIS_D41  (via drill 0.3)
  Top 0.203: J1.12 22.7,44.73 v23.88,43.56 | U7.D41 20.94,26.67 v23.24,26.67
  Bottom 0.203: v23.88,43.56 26.29,43.56 27.3,42.55 27.3,30.35 26.67,29.72 24.13,29.72 23.24,28.83 v23.24,26.67
ARTEMIS_RX0  (via drill 0.3)
  Top 0.203: R2.1 7.87,11.3 v8.38,10.79 9.91,10.79 12.57,13.46 U1.8 | U7.RXI-0 30.93,20.63 31.62,19.94 31.62,16.26 30.73,15.37 v24,15.37
  Bottom 0.203: v8.38,10.79 8.38,13.46 RX0.P$1 10.29,15.37 v24,15.37
ARTEMIS_SWDCK  (via drill 0.3)
  Top 0.203: U7.SWDCK 26.73,20.13 25.91,20.95 v25.91,25.27
  Bottom 0.203: DEBUG.4 42.29,26.04 42.04,26.29 35.81,26.29 33.66,24.13 28.96,24.13 27.81,25.27 v25.91,25.27
ARTEMIS_SWDIO  (via drill 0.3)
  Top 0.203: U7.SWDIO 28.34,24.13 27.83,23.62 27.05,23.62 26.67,24 v26.67,25.78
  Bottom 0.203: DEBUG.2 46.86,27.3 46.23,26.67 35.56,26.67 33.4,24.51 29.21,24.51 27.94,25.78 v26.67,25.78
ARTEMIS_TX0  (via drill 0.3)
  Top 0.203: R3.1 10.03,11.98 10.67,12.61 v10.67,13.84 11.68,13.84 12.07,14.23 U1.9 | U7.TXO-0 31.49,23.63 33.4,21.72 33.4,16.66 v33.37,16.64
  Bottom 0.203: TX0.P$1 10.67,13.21 v10.67,13.84 11.43,14.61 24.26,14.61 25.02,15.37 30.73,15.37 32,16.64 v33.37,16.64
CC3
  Top 0.203: J2.B5 12.54,8.7 R4.2
CC4
  Top 0.203: J2.A5 9.54,8.7 R20.2
D+2
  Top 0.203: J2.A6 10.54,5.33 10.67,5.21 11.43,5.21 11.56,5.33 11.56,6.12 J2.B6 11.57,6.17 U1.1
D-2
  Top 0.203: J2.A7 11.04,7.62 | 11.04,7.62 11.04,11.3 11.3,11.56 11.81,11.56 12.07,11.29 U1.2 | J2.B7 10.04,7.38 10.29,7.62 11.04,7.62
EXT_PWR  (via drill 0.3)
  Top 0.203: 25.02,49.66 25.02,49.78 24.7,50.1 J1.1 | J1.2 24.7,46.93 25.02,47.24 | v42.65,56.5 42.65,56.37 | R13.2 42.25,19.65 43.18,20.57 43.18,30.04 v43.12,30.1
  Top 0.305: v27.18,47.5 27.18,48.32 | U5.4 42.38,56.09 42.65,56.37 | v43.12,30.1 43.56,30.54 43.56,36.58 44.32,37.34 45.59,37.34 45.85,37.59 v45.85,38.48
  Top 0.61: 25.02,48.32 27.18,48.32 28.45,48.32 Q1.2 | 25.02,48.32 25.02,49.66 | 25.02,47.24 25.02,48.32
  Bottom 0.305: v27.18,47.5 5V3.P$1 30.48,45.72 39.32,45.72 40.51,44.53 40.51,30.99 41.4,30.1 v43.12,30.1 | v42.65,56.5 42.92,56.77 46.99,56.77 48.9,54.86 48.9,48.01 48.13,47.24 47.37,47.24 46.74,46.61 46.74,43.43 45.85,42.55 v45.85,38.48
GND  (via drill 0.2, 0.3)
  Top 0.203: 24.3,48.26 J1.3 24.3,51.9 24.13,52.07 | 24.3,48.26 24.3,47.5 | 24.3,47.5 J1.4 24.3,45.17 25.4,44.07 v26.54,44.07 | 24.3,48.26 v23.88,48.26 22.35,48.26 | v23.88,47.5 24.3,47.5 | J1.8 23.5,47.12 v23.88,47.5 | J1.18 21.5,46.9 22.1,47.5 22.35,47.5 | 22.35,47.5 v23.88,47.5 | J1.14 22.3,47.45 22.35,47.5 | J1.13 22.3,48.31 22.35,48.26 | U2.8 U2.11 | v14.99,7.24 14.31,7.91 R4.1 14.31,9.31 13.97,9.65 12.7,9.65 12.57,9.78 U1.3 | R20.1 7.79,8.42 v6.6,7.24 | C7.2 13.68,18.03 | 13.68,18.03 C1.2 | v14.86,18.03 13.68,18.03 | S1.1 1.27,26.29 v0.89,25.91 | S1.2 6.86,26.29 v7.24,25.91 | v19.56,19.56 19.63,19.63 U7.GND@59 25.22,19.63 v25.4,19.81 25.58,19.63 U7.GND@1 30.68,19.63 v30.86,19.81 | v19.56,25.4 19.79,25.63 U7.GND@47 23.14,25.63 v23.24,25.53 | U7.GND@38 19.79,30.63 v19.56,30.86 | v19.56,30.86 18.54,30.86 17.62,31.79 C20.1 | U7.GND@39 19.9,29.63 19.56,29.97 v19.56,30.86 | v30.48,31.62 29.9,31.04 U7.GND@22 | v34.8,19.43 34.8,19.03 B1.- 37.01,17.47 v38.86,15.62 39.37,15.62 39.88,15.11 39.88,9.91 39.05,9.08 | R28.1 v28.7,13.72 28.7,13.21 28.32,12.83 23.88,12.83 v23.75,12.7 | U9.2 v19.81,12.7 19.81,12.32 19.3,11.81 17.57,11.81 C8.2 | v49.15,7.24 49.15,8.39 D6.C D4.C D1.C | D3.C 49.06,22.06 DEBUG.9 49.02,22.23 49.78,22.99 49.78,24.13 49.15,24.77 DEBUG.5 DEBUG.3 | v38.86,4.32 38.86,4.83 39.24,5.21 QWIIC.1 | U4.3 44.22,52.3 43.56,52.96 v43.56,53.09 42.33,53.09 C11.2 | U4.5 45.22,52.2 v45.72,52.7 46.23,52.7 | 46.23,52.7 46.74,52.7 | 46.74,52.7 v48.26,52.7 48.26,51.94 | 48.26,51.94 48.26,51.44 | 48.26,51.44 48.26,50.93 | 48.26,50.93 48.26,50.42 | 48.26,50.42 48.26,50.41 U4.12 | U4.11 48.25,50.91 48.26,50.93 | U4.10 48.24,51.41 48.26,51.44
  Top 0.203: U4.9 48.23,51.91 48.26,51.94 | U4.8 46.74,51.94 46.74,52.7 | U4.7 46.22,52.69 46.23,52.7 | v40.26,52.45 40.55,52.16 C11.2 | U5.2 41.15,52.41 C11.2 | U4.29 43.69,49.91 | v48.26,49.53 48.26,50.42 | U4.1 41.65,51.91 C11.2 | U4.17 47.34,47.91 SPI.1 | 22.35,48.26 22.23,48.26 21.9,48.58 J1.15 | v42.93,37.72 44.32,39.12 46.23,39.12 46.74,38.61 46.74,37.34 v46.23,36.83 | U4.44 43.94,48.64 v43.94,48.51 | v43.94,48.51 43.69,48.77 43.69,49.91 | v43.94,48.51 44.2,48.51 | 44.2,48.51 45.72,48.51 | 45.72,48.51 v46.6,48.51 46.61,48.52 | U4.40 46.61,48.52 | 46.61,48.52 v46.61,48.51 | U4.41 45.72,48.51 | U4.46 43.69,49.91 | U4.31 43.57,50.91 43.69,50.8 43.69,50.42 | 43.69,50.42 43.69,49.91 | U4.47 43.69,50.41 43.69,50.42 | U4.37 v46.61,51.31 46.61,50.42 | U4.23 44.22,48.49 44.2,48.51 | C24.2 38.48,8.6 v38.48,9.65 39.05,9.08 | v44.58,6.86 43.94,7.49 40.64,7.49 39.05,9.08 | v17.78,17.65 18.8,17.65 19.43,17.02 19.43,15.62 19.81,15.24 22.99,15.24 23.37,14.86 v25.4,14.86 | v32,27.3 32.64,27.94 38.73,27.94 39.46,28.66 R30.2 | 46.61,50.42 46.61,49.91 | 46.61,49.91 46.61,49.4 | 46.61,49.4 46.61,48.52 | U4.39 46.6,49.41 46.61,49.4 | U4.38 46.6,49.91 46.61,49.91 | U4.49 46.6,50.41 46.61,50.42 | C19.1 21.46,37.72 v21.97,38.23 | C18.1 24,37.72 v23.5,38.23
  Top 0.305: C22.2 16.97,35.76 v16.13,34.92 | C23.2 17.02,34.29 v16.13,33.4 16.82,32.72 C20.1 | C25.2 9.91,31.92 v9.91,31.88 | R27.1 10.79,30.99 v9.91,31.88 | C28.2 10.96,32.93 v9.91,31.88 | U6.3 11.27,41.27 C12.2 v11.56,42.16 | C27.2 5.33,35.73 v5.33,35.05 5.33,34.04 4.95,33.66 U10.2 2.81,33.66 C21.2 1.91,30.95 C29.2 1.36,30.7 1.02,30.35 1.02,27.18 S1.1 S1.2 | v29.34,41.02 29.59,41.27 C9.2 30.39,41.35 R14.2 32.64,43.6 32.64,45.97 32.13,46.48 U3.2 30.99,46.48 29.38,44.87 C10.2 | R6.1 14.1,48.05 | 14.1,48.05 v14.1,47.88 | R7.2 14.99,48.93 14.1,48.05 | v9.91,53.47 U2.11 9.91,57.1 9.18,57.82 | v13.46,54.48 C2.2 | v6.99,51.31 6.99,52.41 R5.1 | C4.2 9.18,57.82 | 9.18,57.82 v9.14,57.78 | C8.2 16.38,11.05 v15.62,10.29 | C17.2 v15.62,16.13 | v36.58,41.15 36.59,41.14 C13.2 | R23.2 34.63,31.54 v34.67,31.5 | R30.2 39.37,29.81 v39.37,31.75 39.1,32.02 Q4.2 | v33.4,10.16 33.4,7.62 | 33.4,7.62 33.4,7.4 J3.1 | v35.56,7.62 33.4,7.62 | v24.13,6.6 24,6.6 J5.1 | J2.GND 7.57,6.91 7.24,7.24 v6.6,7.24 | J2.GND2 14.02,6.91 14.35,7.24 v14.99,7.24 | U8.1 13.02,30.8 v12.19,31.62
  Top 0.406: 24.13,52.07 24,52.2 19.24,52.2 SC2-.1
  Top 0.508: J5.1 23.23,9.67 v22.73,10.16
  Top 0.813: C6.- 19.08,54.83 SC2-.1
  Bottom 0.203: v42.93,33.53 43.94,33.53 44.7,34.29 44.7,35.94 45.59,36.83 v46.23,36.83 | v26.67,50.67 27.94,50.67 29.34,49.28 29.34,47.62 30.73,46.23 38.48,46.23 v38.61,46.35 38.61,46.99 38.23,47.37 34.8,47.37 v31.37,50.8 | v43.31,44.45 43.05,44.45 42.16,45.34 42.16,46.74 v43.94,48.51
  Bottom 0.305: v39.62,38.99 40.01,39.37 40.01,41.78 38.35,43.43 v36.07,43.43
  other vias: 8.89,36.2 6.73,19.18 7.62,21.59 3.81,21.59 3.81,19.05 38.99,51.94 38.99,48.39 36.2,48.39 36.2,51.94 36.83,58.67 41.91,58.67 43.18,57.53 45.97,54.86 41.02,24 45.47,24 26.16,26.92 27.81,26.92 31.75,37.34 31.75,36.32 19.43,40.13 15.24,40.13 15.24,38.23 18.8,38.23 15.88,36.32 11.3,37.21 17.4,44.32 15.88,46.35 18.41,48.9 12.06,45.47 8.89,45.72 8.89,48.26 5.08,57.15 5.08,50.8 12.95,58.93 15.62,57.66 10.79,61.72 15.24,61.72 25.27,61.85 6.35,59.69 33.66,61.72 25.4,54.61 35.94,54.74 44.45,60.96 49.53,51.31 39.37,34.29 35.81,34.29 43.31,41.91 20.32,44.45 25.15,42.8 27.05,45.21 46.74,42.42 42.93,35.69 48.77,28.83 36.45,14.48 32.38,4.32 41.4,2.54 27.3,6.22 19.68,6.48 17.02,2.03 22.23,2.54 27.3,2.54 32.38,2.41 19.94,10.03 14.99,12.57 3.81,6.35 1.27,7.62 6.35,12.7 3.94,25.4 0.76,33.66 0.89,29.84 2.92,36.83 3.05,39.37 7.49,10.03 14.61,10.16 12.32,12.19 16.26,21.08 17.53,29.08 12.95,35.43 31.75,38.61 35.05,38.61 33.27,42.29 24.51,40.64 30.48,53.34 49.78,5.08 45.09,3.17 43.05,12.32 43.05,9.78 42.42,17.4 46.1,21.34 3.43,41.91 17.4,23.5 19.18,23.37 16.13,26.92 18.03,25.02 48.77,56.64 37.21,38.99 31.37,48.39 22.99,21.21 26.16,28.45 27.81,28.45 25.27,32.26 31.75,13.97 11.56,25.78 7.75,1.27 13.84,1.27 17.02,6.35 22.73,34.67 20.32,33.53 13.84,27.81 7.24,31.62 3.81,9.4
  pour Bottom (isolate 0.305, rank 2): 0,0 0,63.5 50.8,63.5 50.8,0
  pour Top (isolate 0.305, rank 2): 0,0 0,63.5 50.8,63.5 50.8,0
  pour Top (isolate 0.102): 34.8,47.37 34.8,63.5 47.75,63.5 47.75,47.37
  pour Bottom (isolate 0.102): 34.8,47.37 34.8,63.5 47.75,63.5 47.75,47.37
GNSS
  Top 0.203: 44.7,52.7 44.7,51.93 arc90 U4.4
  Top 0.813: C15.2 44.7,52.7
IRIDIUM
  Top 0.813: J6.FEED C14.2
LTC3225_VOUT
  Top 0.203: 10.85,58.89 C4.1 | U2.10 10.85,57.2 10.92,57.28
  Top 0.305: 10.92,58.81 10.85,58.89
  Top 0.406: 10.92,57.28 10.92,58.81
  Top 0.508: U3.6 34.19,50.52 33.69,51.02 R9.2
  Top 0.61: SC1+.1 R9.2 | C5.+ 31.72,59.97 31.24,60.45 12.41,60.45 C4.1
  Top 0.813: C5.+ 31.72,54.77 SC1+.1
N$1  (via drill 0.3)
  Top 0.203: U2.3 7.75,55.5 v7.49,55.24
  Top 0.813: SC2+.1 22.58,53.94 v22.58,55.75 C6.+ C5.- 28.22,53.94 SC1-.1
  Bottom 0.203: v7.49,55.24 8,55.75 v22.58,55.75
N$2  (via drill 0.3)
  Top 0.305: v12.19,51.56 12.28,51.56 R6.2
  Bottom 0.305: JP1.3 12.45,52.96 12.19,52.7 v12.19,51.56
N$3  (via drill 0.3)
  Top 0.203: R1.1 44.7,12.81 v44.7,12.57
  Bottom 0.203: JP2.2 44.7,13.01 v44.7,12.57
N$4  (via drill 0.3)
  Top 0.305: v16.13,51.69 15.11,50.67 R7.1
  Bottom 0.305: JP1.1 15.88,52.96 16.13,52.7 v16.13,51.69
N$5
  Top 0.203: R12.1 D2.A
N$6
  Top 0.203: R13.1 D3.A
N$8
  Top 0.508: U3.5 33.27,46.48 32.89,46.86 R9.1
  Top 0.61: Q1.3 32.85,49.28 R9.1
N$9
  Top 0.203: U2.2 7.41,56.01 C3.2
N$10
  Top 0.203: C3.1 7.53,58.13 8,57.66 8,56.77 8.28,56.49 U2.1
N$11  (via drill 0.3)
  Top 0.203: v11.66,55.12 11.53,54.99 U2.7
  Bottom 0.305: v11.66,55.12 11.79,55.24 13.72,55.24 14.1,54.86 JP1.2
N$12  (via drill 0.3)
  Top 0.203: v37.72,46.86 37.55,46.7 R10.1 | Q1.1 29.65,50.23 v29.97,50.55
  Bottom 0.203: v29.97,50.55 29.97,47.75 30.86,46.86 v37.72,46.86
N$13
  Top 0.203: R11.1 34.19,43.37 U3.4 34.73,45 R10.2
N$14
  Top 0.203: C9.1 32.26,41.44 R11.2
N$15
  Top 0.305: U3.1 30.07,47.43 C10.1
N$16
  Top 0.203: L1.2 41.4,47.75 41.66,48.01 42.29,48.01 42.7,48.41 U4.26
N$17
  Top 0.203: C11.1 L1.1 43.21,48.91 U4.27
N$18
  Top 0.203: U4.18 46.72,47.03 47.1,46.65 X2.P$2
N$19
  Top 0.203: U4.19 46.22,46.47 44.96,45.21 X2.P$1
N$20
  Top 0.203: R15.2 35.09,12.19 D5.C
N$21
  Top 0.203: R16.1 D4.A
N$22
  Top 0.203: R2.2 D13.C
N$23  (via drill 0.3)
  Top 0.203: v46.48,12.45 46.99,12.45 47.31,12.76 D1.A
  Bottom 0.203: JP2.1 46.28,12.65 v46.48,12.45
N$24  (via drill 0.3)
  Top 0.203: U4.16 48.23,48.41 v48.26,48.39 | v45.21,37.97 44.32,37.97 42.92,36.57 D11.C D12.C
  Bottom 0.203: v48.26,48.39 47.24,48.39 46.23,47.37 46.23,43.56 45.21,42.55 v45.21,37.97
N$25  (via drill 0.2)
  Top 0.203: U4.34 44.45,51.18 v44.45,51.44
  Bottom 0.203: v44.45,51.44 43.81,51.44 SAFEBOOT.P$1
N$26  (via drill 0.3)
  Top 0.203: U4.22 44.72,47.66 44.43,47.37 43.69,47.37 v43.43,47.12
  Bottom 0.203: v43.43,47.12 43.43,45.97 GPS_RX.P$1
N$27  (via drill 0.3)
  Top 0.203: U4.21 45.22,47.63 v44.32,46.74
  Bottom 0.203: v44.32,46.74 44.32,44.32 GPS_TX.P$1
N$28
  Top 0.406: U5.1 arc-90 40.45,53.85 39.75,53.85
  Top 0.813: C14.1 38.39,55.71 arc-90 39.12,54.99 39.12,54.48 arc90 39.75,53.85
N$29
  Top 0.406: 42.55,53.85 41.84,53.85 arc-90 U5.3
  Top 0.813: C15.1 43.9,55.71 arc90 43.18,54.99 43.18,54.48 arc-90 42.55,53.85
N$30
  Top 0.406: 41.15,57.75 C16.2 | 41.15,57.15 U5.5
  Top 0.813: C16.2 41.15,57.75 41.15,57.15
N$32
  Top 0.203: R3.2 D7.C
N$35
  Top 0.203: R21.1 D6.A
N$36  (via drill 0.3)
  Top 0.203: U10.3 4,32.7 v3.17,31.88
  Bottom 0.203: v3.17,31.88 3.17,15.24
  Bottom 0.406: EN.1 3.17,15.24 3.43,15.24 3.81,14.86 3V3EN.2
N$37
  Top 0.305: R22.1 39.14,36.01 Q3.1 37.32,34.14 Q4.3
N$39
  Top 0.203: U9.5 24.06,13.65 24.13,13.72 R28.2
N$40
  Top 0.305: R29.2 16.78,12.73 D9.C
N$41
  Top 0.305: R29.1 19.45,13.65 U9.1
N$46
  Top 0.305: R24.1 35.28,36.92 Q3.3
N$47
  Top 0.305: Q4.1 36.39,31.18 36.03,30.82 R25.2
V_AAA
  Top 0.508: J3.2 31.39,9.13 28.82,11.69 D10.A
V_BATT
  Top 0.305: 18.8,10.75 C8.1
  Top 0.508: C8.1 18.56,10.99 20.42,10.99 U9.3 21.23,11.7 J5.2 | D8.A 18.8,10.75
V_BCKP  (via drill 0.3)
  Top 0.203: D12.A 42.64,31.77 42.64,20.67 41.37,19.4 41.37,12.45 v41.5,12.32 | v38.73,12.32 38.73,11.81 38.48,11.56 R15.1 37.43,12.74 37.08,13.08 35.44,13.08 B1.+
  Bottom 0.203: v41.5,12.32 v38.73,12.32
V_USB
  Top 0.203: D5.A 29.97,12.19 29.72,12.45 27.17,12.45 D14.A
  Top 0.305: J2.VBUS2 13.24,5.75 11.81,4.32 10.92,4.32 9.78,4.32 8.35,5.75 J2.VBUS1
  Top 0.508: C17.1 18.53,16.1 D9.A 18.78,14.61 21.97,14.61 22.48,14.1 22.48,12.19 22.92,11.75 U9.4 23.84,11.69 D14.A 25.79,11.69 25.15,11.05
  Top 0.813: 10.92,4.32 11.68,3.56 16.13,3.56 17.4,4.83 19.81,4.83 20.45,4.19 23.88,4.19 25.15,5.46 25.15,11.05
VBUS  (via drill 0.4)
  Top 0.61: D8.C v16.51,8.13
  Top 0.813: D10.C 28.45,8.64 v27.94,8.13 v26.67,8.13 26.42,8.38 D14.C | v17.78,8.13 16.63,8.13 16.5,8.26 D8.C
  Bottom 0.406: J4.2 3.17,10.16 3.81,10.79 MEAS.1
  Bottom 0.813: J4.2 3.3,8.13 v16.51,8.13 v17.78,8.13 v26.67,8.13 v27.94,8.13
VIN  (via drill 0.3, 0.4)
  Top 0.305: R22.2 39.14,37.91 Q3.2 37.02,37.91 35.69,39.24 22.73,39.24 v22.61,39.12
  Top 0.61: U10.1 4.03,34.7 v3.17,35.56 2.03,35.56 1.91,35.43 C21.1
  Bottom 0.305: v3.17,35.56 4.57,36.96 4.57,40.51 5.33,41.27 10.92,41.27 13.08,39.12 v22.61,39.12
  Bottom 0.406: MEAS.2 3.81,12.7 3V3EN.1
  Bottom 0.61: J4.1 3.81,12.7 5.08,12.7
  Bottom 0.813: 5.08,12.7 5.08,33.66 v3.17,35.56 v1.91,35.56
XTALI
  Top 0.203: U7.XI 22.86,30.67 22.86,32.38 22.1,33.15 X1.P$1 21.48,35.33 C19.2
XTALO
  Top 0.203: U7.XO 23.4,31.27 23.98,31.86 23.98,33.02 | 23.98,33.02 X1.P$2 | C18.2 24,33.04 23.98,33.02

## Text on the board
Top: TOP
Bottom: BOT | X01
tPlace: + | + | + | - | + | -
bPlace: - | - | - | - | - | - | + | + | Supercapacitor / 10F 2.7V | Supercapacitor / 10F 2.7V